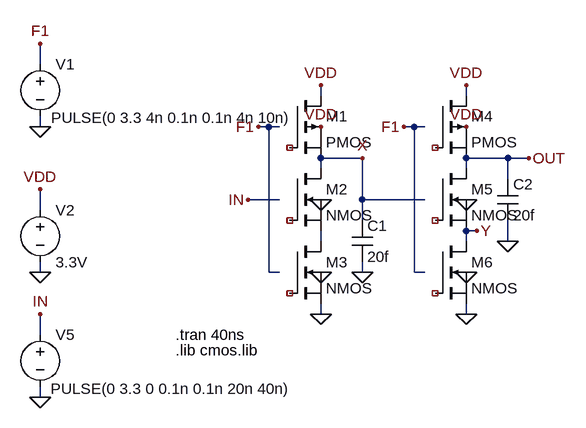
[diagram p0: schematic pe_inv_cascade.asc]
pe_inv_cascade.asc, the LTspice schematic file:
Version 4
SHEET 1 1292 680
WIRE -1920 -448 -1920 -480
WIRE -1488 -400 -1488 -416
WIRE -1264 -400 -1264 -416
WIRE -1920 -352 -1920 -368
WIRE -1568 -352 -1584 -352
WIRE -1552 -352 -1568 -352
WIRE -1344 -352 -1360 -352
WIRE -1328 -352 -1344 -352
WIRE -1424 -304 -1488 -304
WIRE -1200 -304 -1264 -304
WIRE -1168 -304 -1200 -304
WIRE -1488 -288 -1488 -304
WIRE -1264 -288 -1264 -304
WIRE -1200 -272 -1200 -304
WIRE -1552 -240 -1600 -240
WIRE -1424 -240 -1424 -304
WIRE -1328 -240 -1424 -240
WIRE -1920 -224 -1920 -256
WIRE -1424 -208 -1424 -240
WIRE -1248 -192 -1264 -192
WIRE -1488 -176 -1488 -192
WIRE -1264 -176 -1264 -192
WIRE -1200 -176 -1200 -208
WIRE -1920 -128 -1920 -144
WIRE -1568 -128 -1568 -352
WIRE -1552 -128 -1568 -128
WIRE -1424 -128 -1424 -144
WIRE -1344 -128 -1344 -352
WIRE -1328 -128 -1344 -128
WIRE -1488 -64 -1488 -80
WIRE -1264 -64 -1264 -80
WIRE -1920 -32 -1920 -64
WIRE -1920 64 -1920 48
FLAG -1264 -64 0
FLAG -1360 -352 F1
FLAG -1488 -64 0
FLAG -1584 -352 F1
FLAG -1920 -128 0
FLAG -1920 -352 0
FLAG -1920 -256 VDD
FLAG -1920 -480 F1
FLAG -1424 -304 X
FLAG -1168 -304 OUT
FLAG -1264 -416 VDD
FLAG -1600 -240 IN
FLAG -1248 -192 Y
FLAG -1424 -128 0
FLAG -1200 -176 0
FLAG -1920 64 0
FLAG -1920 -64 IN
FLAG -1488 -240 0
FLAG -1488 -128 0
FLAG -1264 -240 0
FLAG -1264 -128 0
FLAG -1488 -352 VDD
FLAG -1264 -352 VDD
FLAG -1488 -416 VDD
SYMBOL pmos -1312 -400 R0
SYMATTR InstName M4
SYMATTR Value2 l=0.6u w=3u
SYMBOL pmos -1536 -400 R0
SYMATTR InstName M1
SYMATTR Value2 l=0.6u w=3u
SYMBOL voltage -1920 -464 R0
WINDOW 123 0 0 Left 2
WINDOW 39 0 0 Left 2
WINDOW 3 17 98 Left 2
SYMATTR InstName V1
SYMATTR Value PULSE(0 3.3 4n 0.1n 0.1n 4n 10n)
SYMBOL voltage -1920 -240 R0
WINDOW 123 0 0 Left 2
WINDOW 39 0 0 Left 2
SYMATTR InstName V2
SYMATTR Value 3.3V
SYMBOL nmos -1536 -288 R0
SYMATTR InstName M2
SYMATTR SpiceModel ""
SYMATTR Value NMOS
SYMATTR Value2 l=0.6u w=6u
SYMBOL nmos -1536 -176 R0
SYMATTR InstName M3
SYMATTR SpiceModel ""
SYMATTR Value NMOS
SYMATTR Value2 l=0.6u w=6u
SYMBOL nmos -1312 -288 R0
SYMATTR InstName M5
SYMATTR SpiceModel ""
SYMATTR Value NMOS
SYMATTR Value2 l=0.6u w=6u
SYMBOL nmos -1312 -176 R0
SYMATTR InstName M6
SYMATTR SpiceModel ""
SYMATTR Value NMOS
SYMATTR Value2 l=0.6u w=6u
SYMBOL cap -1440 -208 R0
SYMATTR InstName C1
SYMATTR Value 20f
SYMBOL cap -1216 -272 R0
SYMATTR InstName C2
SYMATTR Value 20f
SYMBOL voltage -1920 -48 R0
WINDOW 123 0 0 Left 2
WINDOW 39 0 0 Left 2
WINDOW 3 16 99 Left 2
SYMATTR Value PULSE(0 3.3 0 0.1n 0.1n 20n 40n)
SYMATTR InstName V5
TEXT -1712 -8 Left 2 !.lib cmos.lib
TEXT -1712 -32 Left 2 !.tran 40ns

The netlist it stands for:
* pe_inv_cascade.asc
* M4: PMOS l=0.6u w=3u (symbol pmos not certain, pin order unknown); nets seen at it: OUT, VDD
* M1: PMOS l=0.6u w=3u (symbol pmos not certain, pin order unknown); nets seen at it: VDD, X
V1 F1 0 PULSE(0 3.3 4n 0.1n 0.1n 4n 10n)
V2 VDD 0 3.3V
* M2: NMOS l=0.6u w=6u (symbol nmos not certain, pin order unknown); nets seen at it: N001, X
* M3: NMOS l=0.6u w=6u (symbol nmos not certain, pin order unknown); nets seen at it: 0, N001
* M5: NMOS l=0.6u w=6u (symbol nmos not certain, pin order unknown); nets seen at it: OUT, Y
* M6: NMOS l=0.6u w=6u (symbol nmos not certain, pin order unknown); nets seen at it: 0, Y
C1 X 0 20f
C2 OUT 0 20f
V5 IN 0 PULSE(0 3.3 0 0.1n 0.1n 20n 40n)
.lib cmos.lib
.tran 40ns
.backanno
.end